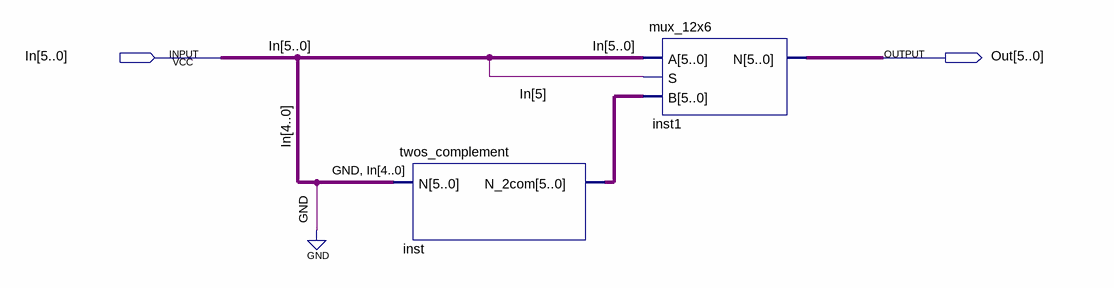
[diagram p0: schematic sheet]
// Quartus schematic conditional_2complement.bdf as structural Verilog: 2 symbols, 2 pins
module conditional_2complement (
  input  [5:0] In,
  output [5:0] Out
);

  wire [5:0] inst_n_2com;

  twos_complement inst (.N({1'b0, In[4:0]}), .N_2com(inst_n_2com));
  mux_12x6 inst1 (.A(In), .S(In[5]), .B(inst_n_2com), .N(Out));
endmodule
